# Altium schematic sheet HX711.SchDoc
size Letter
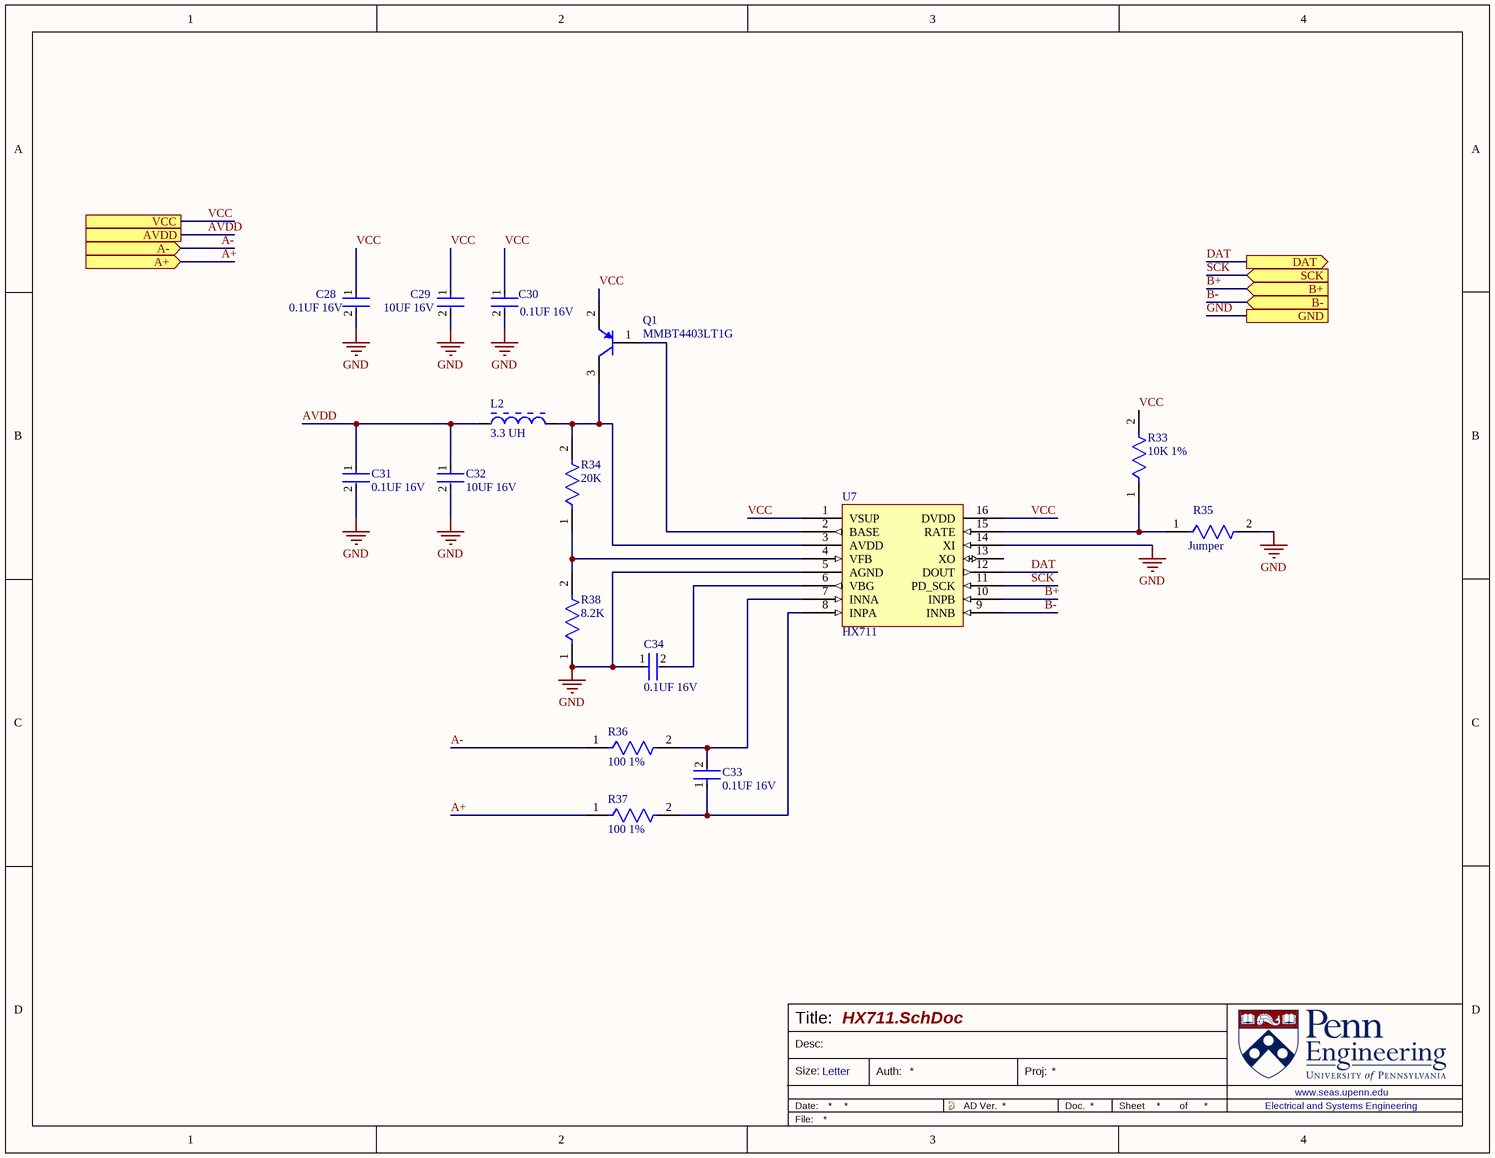
[diagram p0: HX711.SchDoc]

## Parts
C28  0.1UF 16V  [FP-CC0402-MFG]
C29  10UF 16V  [FP-CC0603-DB-MFG]
C30  0.1UF 16V  [FP-CC0402-MFG]
C31  0.1UF 16V  [FP-CC0402-MFG]
C32  10UF 16V  [FP-CC0603-DB-MFG]
C33  0.1UF 16V  [FP-CC0402-MFG]
C34  0.1UF 16V  [FP-CC0402-MFG]
L2  3.3 UH  [BOUR-SRN3015-2_V]
Q1  MMBT4403LT1G  [ONSC-SOT-23-3-318-08_V]
R33  10K 1%  [FP-RNCP0603-IPC_A]
R34  20K  [FP-RMCF0402-IPC_A]
R35  Jumper  [FP-RMCF0603-MFG]
R36  100 1%  [FP-RMCF0603-IPC_C]
R37  100 1%  [FP-RMCF0603-IPC_C]
R38  8.2K  [FP-RMCF0603-IPC_A]
U7  HX711  [SOIC127P600X160-16N]

## Ports
A+ (in), A- (in), AVDD, B+ (in), B- (in), DAT (out), GND, SCK (in), VCC

## Nets
GND: C28.2 C29.2 C30.2 C31.2 C32.2 C34.1 R35.2 R38.1 U7.5(AGND) U7.14(XI) ; port GND
A+: R37.1 ; port A+
A-: R36.1 ; port A-
AVDD: C31.1 C32.1 L2.1 ; port AVDD
B+: U7.10(INPB) ; port B+
B-: U7.9(INNB) ; port B-
DAT: U7.12(DOUT) ; port DAT
SCK: U7.11(PD_SCK) ; port SCK
VCC: C28.1 C29.1 C30.1 Q1.2(E) R33.2 U7.1(VSUP) U7.16(DVDD) ; port VCC
NetC33_1: C33.1 R37.2 U7.8(INPA)
NetC33_2: C33.2 R36.2 U7.7(INNA)
NetC34_2: C34.2 U7.6(VBG)
NetL2_2: L2.2 Q1.3(C) R34.2 U7.3(AVDD)
NetQ1_1: Q1.1(B) U7.2(BASE)
NetR33_1: R33.1 R35.1 U7.15(RATE)
NetR34_1: R34.1 R38.2 U7.4(VFB)

Not connected (* = marked no-connect by the designer): U7 13(XO)

## Notes on the sheet
- Title:
- Desc:
- Size:
- Letter
- Auth:
- Proj:
- Sheet
- of
- www.seas.upenn.edu
- Electrical and Systems Engineering

## Library data of the parts
C28 C30 C31 C33 C34 = CMP-03422-000946-1: CC0402 100 nF X7R 10.00% 25 V; Manufacturer Part Number: CC0402KPX7R8BB104; Manufacturer: YAGEO; Capacitance: 100 nF; Material: Ceramic; Tolerance: 0.1; Value: 100 nF; Temperature Coefficient: 30ppm/°C; Automotive Grade: NA; Voltage Rating: 25 V; Footprint Url: http://www.yageo.com/exep/pages/download/literatures/UPY-C_GEN_24.pdf; ComponentLink2Description: Datasheet; Device Class L2: Capacitors; Device Class L3: Ceramic Capacitors; Height: 0.55mm; Ipc Land Pattern Name: CAPC10050X50; Category: Cap; ComponentLink2URL: http://www.yageo.com/documents/recent/UPY-GP_NP0_16V-to-50V_16.pdf; Automotive: No; Temperature: -55°C to +125°C; Lead Free: Yes; Temperature Range High: +125°C; Temperature Range Low: -55°C; Temperature Characteristic: X7R; Package: CC0402; RoHS: TRUE; Octopart: https://octopart.com/cc0402kpx7r8bb104-yageo-61757486; Device Class L1: Passive Components
C29 C32 = CMP-1035-02797-2: CAP CER 10UF 6.3V X5R 0603; Dissipation Factor: 10%; Tolerance: 20%; Depth: 0.8mm; Dielectric: X5R; Height: 0.8mm; Min Operating Temperature: -55°C; Package Quantity: 4000; Radiation Hardening: No; Mount: Surface Mount; Termination: SMD/SMT; Case/Package: 0603; Max Operating Temperature: 85°C; Case Code (Imperial): 0603; RoHS Compliant: Yes; Number of Pins: 2; Lead Free: Lead Free; Resistor Type: Ceramic; Thickness: 0.039inch; Construction: Flat; Width: 0.031inch; Length: 1.6mm; Capacitance: 10uF; Voltage Rating: 6.3V; Series: CC; REACH SVHC: No SVHC; Packaging: Tape and Reel; Case Code (Metric): 1608; Voltage Rating (DC): 6.3V; Halogen Free: Halogen Free
L2 = CMP-0007-00001-1: Semi-shielded Power Inductor, 3.3 uH, +/- 20%, 1.6 A, -40 to 125 degC, 3 x 3 x 1.5 mm SMD, RoHS and Halogen Free, Tape and Reel; Manufacturer: Bourns; PartNumber: SRN3015-3R3M; DCR Max: 0.112 Ohm; Resistance to Solder Heat: +260 degC for 10 sec.; Rated current: 1.6 A; SRF Min: 75 MHz; Isat: 1.4 A; Inductance tolerance: +/- 20%; PackageDescription: 2-Pin SMD, Body 3 x 3 mm, Height 1.5 mm; ComponentLink1URL: http://www.bourns.com/; ComponentLink3URL: http://www.bourns.com/data/global/pdfs/SRN3015.pdf; RoHS: TRUE; ComponentLink2URL: http://www.bourns.com/data/global/pdfs/SRN3015.pdf; Inductance: 3.3 uH; DatasheetVersion: Aug-11; ComponentLink3Description: Package Specification; ComponentLink2Description: Datasheet; Packing: Tape and Reel; ComponentLink1Description: Manufacturer URL; Mounting Technology: Surface Mount; PackageReference: SRN3015; Operating Temperature: -40 to 125 degC
Q1 = CMP-1048-00539-1: Switching Transistor, PNP Silicon, 3-Pin SOT-23, Pb-Free, Tape and Reel; Manufacturer: On Semiconductor; fT Min (MHz): 200; IC Continuous (A): -0.6; ComponentLink1URL: http://www.onsemi.com/; ComponentLink2URL: http://www.onsemi.cn/pub_link/Collateral/MMBT4403LT1-D.PDF; PackageVersion: Rev. AP, 11/2009; ComponentLink1Description: Manufacturer URL; PackageDescription: 3-Pin Small Outline Transistor, Body 2.92 x 1.3 mm, Pitch 0.95 mm; Polarity: PNP; ComponentLink3Description: Package Specification; DatasheetVersion: Rev. 12; Mounting Technology: Surface Mount; PackageReference: SOT-23-3-318-08; ComponentLink3URL: http://www.onsemi.cn/pub_link/Collateral/318-08.PDF; Packing: Tape and Reel; PartNumber: MMBT4403LT1G; RoHS: TRUE; ComponentLink2Description: Datasheet
R33 = CMP-26527-000099-1: 10kΩ ±1% 0.125W 0603 High Power Anti-Sulfur Thin Film Chip Resistor; Resistance: 10kR; Max Power Dissipation: 125mW; Temperature Coefficient: 100ppm/°C; Max Operating Temperature: 155°C; Width: 0.031inch; Height: 0.02inch; Lead Free: Lead Free; Contact Plating: Tin; Tolerance: 1%; Resistor Type: Thin Film; Series: RNCP; RoHS Compliant: Yes; Features: Moisture Resistant; Min Operating Temperature: -55°C; Case Code (Metric): 1608; Case/Package: 0603; Mount: Surface Mount; Packaging: Tape and Reel; Radiation Hardening: No; Length: 0.059inch; Number of Terminations: 2; Case Code (Imperial): 0603
R34 = CMP-26527-006055-1: 20kΩ ±1% 0.063W 0402 Thick Film Chip Resistor AEC-Q200 compliant; Resistance: 20kR; Max Power Dissipation: 63mW; Temperature Coefficient: 100ppm/°C; Packaging: Tape and Reel; Lead Free: Lead Free; Min Operating Temperature: -55°C; Case/Package: 0402; Radiation Hardening: No; Series: RMCF; Width: 0.02inch; RoHS Compliant: Yes; Height: 0.016inch; Length: 0.039inch; Contact Plating: Tin; Features: Automotive AEC-Q200; Resistor Type: Thick Film; Case Code (Imperial): 0402; Max Operating Temperature: 155°C; Tolerance: 1%; Mount: Surface Mount; Case Code (Metric): 1005; Number of Terminations: 2
R35 = CMP-26527-000011-1: RES 0 OHM JUMPER 1/10W 0603; Manufacturer Part Number: RMCF0603ZT0R00; Manufacturer: Stackpole; Power Rating: 0.1W; Voltage Rating: 75V; Resistance: 0mΩ; Automotive Grade: Grade 0; Value: 0mΩ; Series: RMCF; Device Class L1: Passive Components; Device Class L3: Chip SMD Resistors; Octopart: https://octopart.com/rmcf0603zt0r00-stackpole+electronics-19213618; Temperature: -55°C to +155°C; Lead Free: Yes; ComponentLink2URL: https://www.seielect.com/catalog/sei-rmcf_rmcp.pdf; Height: 0.55mm; Composition: Thick Film; Package: RMCF0603; Automotive: Yes; Temperature Range High: +155°C; Ipc Land Pattern Name: RESC15580X45; Digikey Description: RES 0 OHM JUMPER 1/10W 0603; RoHS: TRUE; ComponentLink2Description: Datasheet; Temperature Range Low: -55°C; Category: Res; Device Class L2: Resistors
R36 R37 = CMP-26527-006079-1: 100Ω ±1% 0.1W 0603 Thick Film Chip Resistor AEC-Q200 compliant; Resistance: 100R; Power Rating: 100mW; Temperature Coefficient: 100ppm/°C; Radiation Hardening: No; Case Code (Metric): 1608; RoHS Compliant: Yes; Height: 0.022inch; Case/Package: 0603; Construction: Rectangular; Case Code (Imperial): 0603; Series: RMCF; Military Standard: Not; Max Operating Temperature: 155°C; Resistor Type: Thick Film; Depth: 0.8mm; Features: Automotive AEC-Q200; Width: 0.031inch; Length: 1.55mm; Size Code: 0603; Mount: Surface Mount; Contact Plating: Tin; Max Power Dissipation: 100mW; Number of Terminations: 2; Min Operating Temperature: -55°C; Packaging: Tape and Reel; Lead Free: Lead Free; Tolerance: 1%
R38 = CMP-26527-001908-1: 8.2kΩ ±5% 0.1W 0603 Thick Film Chip Resistor AEC-Q200 compliant; Resistance: 8.2kR; Max Power Dissipation: 100mW; Temperature Coefficient: 100ppm/°C; Width: 0.031inch; Case Code (Metric): 1608; Power Rating: 100mW; Case Code (Imperial): 0603; Lead Free: Lead Free; Height: 0.022inch; Contact Plating: Tin; Features: Automotive AEC-Q200; Resistor Type: Thick Film; Tolerance: 5%; RoHS Compliant: Yes; Length: 0.061inch; Packaging: Tape and Reel; Size Code: 0603; Max Operating Temperature: 155°C; Case/Package: 0603; Min Operating Temperature: -55°C; Mount: Surface Mount; Radiation Hardening: No; Series: RMCF; Number of Terminations: 2
U7 = CMP-00100-1: ADC, Delta-Sigma, 24-Bit, 1 Func, 2 Channel, Serial Access, PDSO16